# Altium schematic sheet Sensor-Board.SchDoc
size A4; SheetNumber: 4; SheetTotal: 4; Size: A4
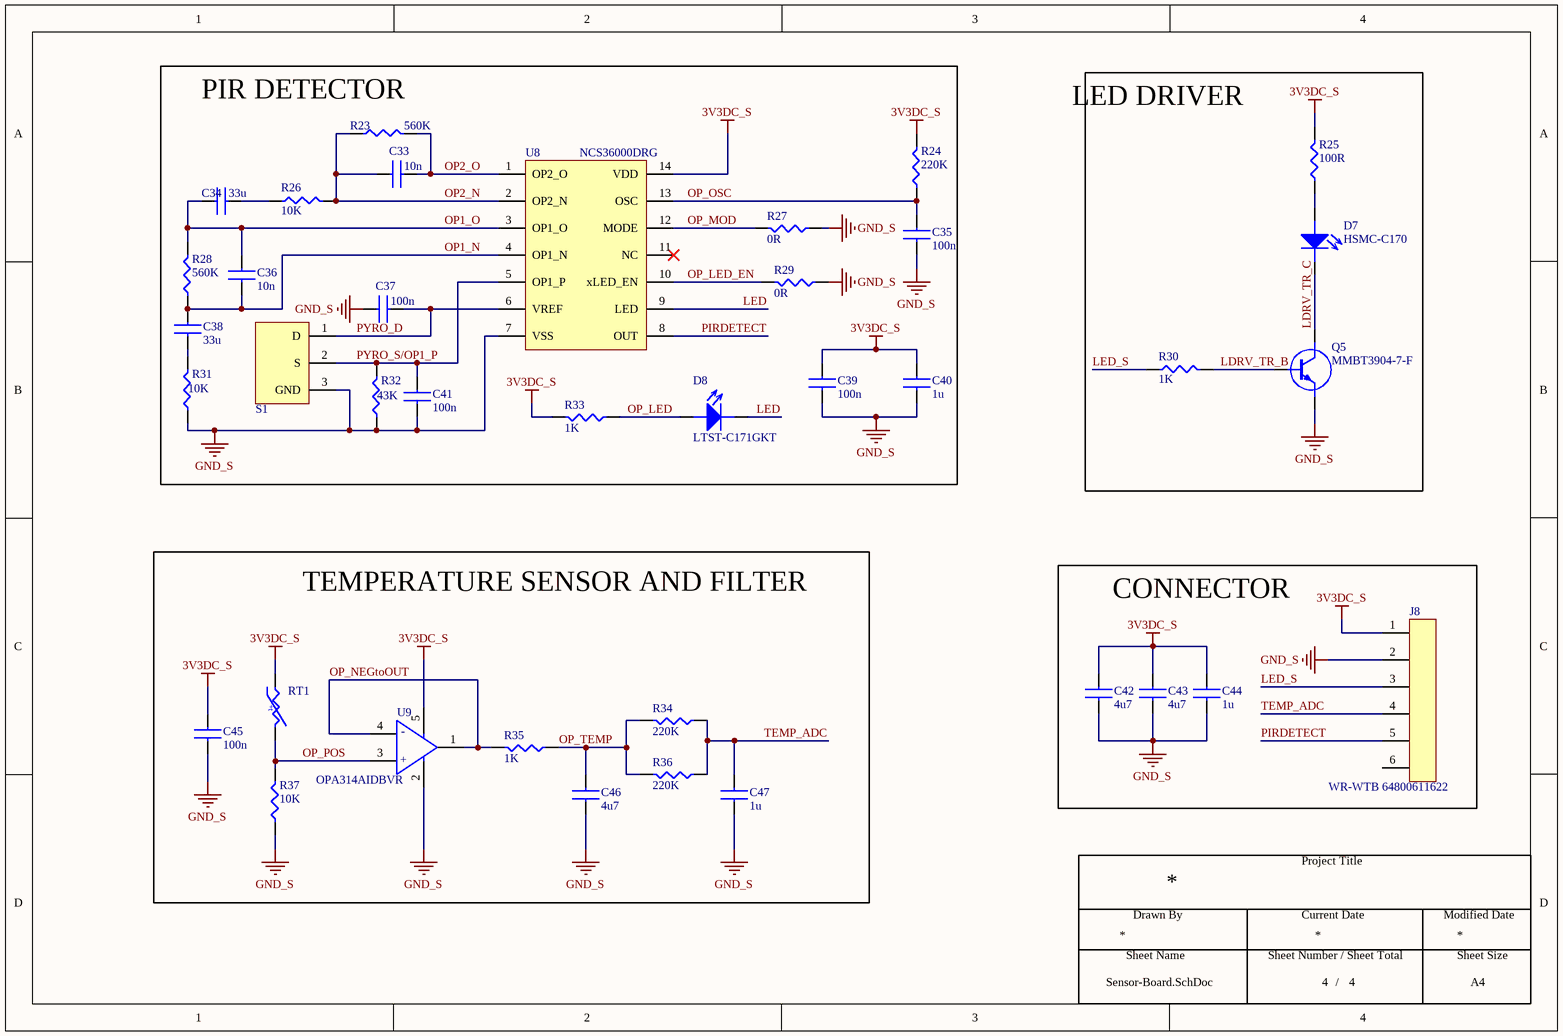
[diagram p0: Sensor-Board.SchDoc]

## Parts
C33  10n  [CAPACITOR 0603]
C34  33u  [CAPACITOR 1206]
C35  100n  [Capacitor 0603]
C36  10n  [CAPACITOR 0603]
C37  100n  [Capacitor 0603]
C38  33u  [CAPACITOR 1206]
C39  100n  [Capacitor 0603]
C40  1u  [CAPACITOR 0805 - duplicate]
C41  100n  [Capacitor 0603]
C42  4u7  [CAPACITOR 0805 - duplicate]
C43  4u7  [CAPACITOR 0805 - duplicate]
C44  1u  [CAPACITOR 0805 - duplicate]
C45  100n  [Capacitor 0603]
C46  4u7  [CAPACITOR 0805 - duplicate]
C47  1u  [CAPACITOR 0805 - duplicate]
D7  HSMC-C170  [LED RED 0805]
D8  LTST-C171GKT  [LED GREEN 0805]
J8  WR-WTB 64800611622  [6P SMD TERMINAL 1.50 MALE]
Q5  MMBT3904-7-F  [SOT-23F]
R23  560K  [Resistor 0603]
R24  220K  [Resistor 0603]
R25  100R  [Resistor 0603]
R26  10K  [Resistor 0603]
R27  0R  [Resistor 0603]
R28  560K  [Resistor 0603]
R29  0R  [Resistor 0603]
R30  1K  [Resistor 0603]
R31  10K  [Resistor 0603]
R32  43K  [Resistor 0603]
R33  1K  [Resistor 0603]
R34  220K  [Resistor 0603]
R35  1K  [Resistor 0603]
R36  220K  [Resistor 0603]
R37  10K  [Resistor 0603]
RT1  TFPT1206L1002FM  [RESISTOR 1206]  (value not drawn)
S1  LHI 878/3902  [LHI 878]  (value not drawn)
U8  NCS36000DRG  [SOIC-14]
U9  OPA314AIDBVR  [SOT23-5]

## Blocks framed on the sheet
PIR DETECTOR: C33-C41 D8 R23 R24 R26-R29 R31-R33 S1 U8
TEMPERATURE SENSOR AND FILTER: C45-C47 R34-R37 RT1 U9
CONNECTOR: C42-C44 J8

## Nets
3V3DC_S: C39.2 C40.2 C42.2 C43.2 C44.2 C45.2 J8.1 R24.2 R25.2 R33.2 RT1.1 U8.14(VDD) U9.5(V+)
GND_S: C35.1 C37.2 C39.1 C40.1 C41.1 C42.1 C43.1 C44.1 C45.1 C46.2 C47.1 J8.2 Q5.2(E) R27.1 R29.1 R31.1 R32.1 R37.1 S1.3(GND) U8.7(VSS) U9.2(V–)
LDRV_TR_B: Q5.1(B) R30.2
LDRV_TR_C: D7.2(C) Q5.3(C)
LED: D8.2(C) U8.9(LED)
LED_S: J8.3 R30.1
OP1_N: C36.1 C38.2 R28.1 U8.4(OP1_N)
OP1_O: C34.1 C36.2 R28.2 U8.3(OP1_O)
OP2_N: C33.1 R23.1 R26.2 U8.2(OP2_N)
OP2_O: C33.2 R23.2 U8.1(OP2_O)
OP_LED: D8.1(A) R33.1
OP_LED_EN: R29.2 U8.10(xLED_EN)
OP_MOD: R27.2 U8.12(MODE)
OP_NEGtoOUT: R35.2 U9.1(OUT) U9.4(-IN)
OP_OSC: C35.2 R24.1 U8.13(OSC)
OP_POS: R37.2 RT1.2 U9.3(+IN)
OP_TEMP: C46.1 R34.2 R35.1 R36.2
PIRDETECT: J8.5 U8.8(OUT)
PYRO_D: C37.1 S1.1(D) U8.6(VREF)
PYRO_S/OP1_P: C41.2 R32.2 S1.2(S) U8.5(OP1_P)
TEMP_ADC: C47.2 J8.4 R34.1 R36.1
NetC34_2: C34.2 R26.1
NetC38_1: C38.1 R31.2
NetD7_1: D7.1(A) R25.1

Not connected (* = marked no-connect by the designer): J8 6; U8 11(NC)*

## Notes on the sheet
- LED DRIVER
- Drawn By
- Project Title
- Current Date
- Modified Date
- Sheet Name
- Sheet Number / Sheet Total
- /
- Sheet Size
- (in symbol OPA314AIDBVR) -; +
- (in symbol TFPT1206L1002FM) +t

## Library data of the parts
C33 C36 = CAP CER 10nF 0603: 0603 16V X7R 10nF 10% multilayer ceramic capacitor; Manufacturer: Walsin Technologies; Manufacturer Part Number: 0603B103K160CT; Designed by: UK; Supplier: Digikey; Supplier Part Number: 1292-1384-6-ND; RoHS: Yes; Category: Ceramic Capacitors; Stock: 66398; Pricing: 1=0.1, 10=0.031, 50=0.018, 100=0.0139, 500=0.0105, 1000=0.00825 (USD); Lead Free: 5697LeadFree; ComponentLink1URL: http://www.farnell.com/datasheets/1958513.pdf?src-supplier=Farnell; ComponentLink1Description: http://www.farnell.com/datasheets/1958513.pdf?src-supplier=Farnell; ComponentLink2URL: https://datasheet.octopart.com/0603B103K160CT-Walsin-Technologies-datasheet-136037192.pdf?src-supplier=Future+Electronics; ComponentLink2Description: https://datasheet.octopart.com/0603B103K160CT-Walsin-Technologies-datasheet-136037192.pdf?src-supplier=Future+Electronics; ComponentLink3URL: http://www.passivecomponent.com/wp-content/uploads/2018/10/MLCC.pdf?src-supplier=Digikey; ComponentLink3Description: http://www.passivecomponent.com/wp-content/uploads/2018/10/MLCC.pdf?src-supplier=Digikey; ComponentLink4URL: https://datasheet.octopart.com/0603B103K160CT-Walsin-Technologies-datasheet-85392065.pdf?src-supplier=Element14; ComponentLink4Description: https://datasheet.octopart.com/0603B103K160CT-Walsin-Technologies-datasheet-85392065.pdf?src-supplier=Element14; ComponentLink5URL: https://datasheet.octopart.com/0603B103K160CT-Walsin-Technologies-datasheet-62066062.pdf?src-supplier=TME; ComponentLink5Description: https://datasheet.octopart.com/0603B103K160CT-Walsin-Technologies-datasheet-62066062.pdf?src-supplier=TME
C34 C38 = CAP CER 33uF 1206: Multilayer Ceramic Capacitor, 33 uF, 25 V, ± 20%, X5R, 1206 [3216 Metric]; Manufacturer: TDK; Manufacturer Part Number: C3216X5R1E336M160AC; Designed by: UK; Material: 4241ConductorMaterial; Supplier: Digikey; Supplier Part Number: 445-8046-2-ND; RoHS: Yes; Category: Ceramic Capacitors; Stock: 166000; Pricing: 2000=0.3605, 4000=0.34763, 10000=0.33475, 14000=0.32831 (USD); ComponentLink1URL: https://datasheet.ciiva.com/24216/c3216x5r1e336m160ac-265051-24216512.pdf?src-supplier=Mouser; ComponentLink1Description: https://datasheet.ciiva.com/24216/c3216x5r1e336m160ac-265051-24216512.pdf?src-supplier=Mouser; ComponentLink2URL: https://datasheet.ciiva.com/6285/tdkmlcccaprange-6285278.pdf?src-supplier=Digikey; ComponentLink2Description: https://datasheet.ciiva.com/6285/tdkmlcccaprange-6285278.pdf?src-supplier=Digikey
C35 C37 C39 C41 C45 = CAP CER 100nF 0603: Multilayer Ceramic Capacitor, 0.1 uF, 50 V, ± 10%, X7R, 0603 [1608 Metric]; Manufacturer: KEMET; Manufacturer Part Number: C0603C104K5RACTU; Material: 4241ConductorMaterial; Value: 100nF; Voltage Rating: 50V; Temperature Coefficient: 30ppm/°C; Designed by: UK; Supplier: Digikey; Supplier Part Number: 399-C0603C104K5RAC7867TR-ND; RoHS: Yes; Category: Ceramic Capacitors; Stock: 3063153; Pricing: 4000=0.01394, 8000=0.01273, 12000=0.01212, 28000=0.01151, 100000=0.00833, 200000=0.00806, 400000=0.00758 (USD); Mounting Technology: Surface Mount; Case/Package: 0603; Min Operating Temperature: -55°C; Max Operating Temperature: 125°C; Tolerance: 10%; Dielectric: X7R; Packaging: Tape and Reel; Voltage: 50V; Series: SMD Comm X7R; Length: 0.063inch; Width: 0.031inch; Thickness: 0.034inch; RoHS Compliant: Yes; Lead Free: 5697LeadFree
C40 C44 C47 = CAP CER 1uF 0805: Multilayer Ceramic Capacitor, 1 uF, 50 V, ± 10%, X7R, 0805 [2012 Metric]; Manufacturer: Samsung; Manufacturer Part Number: CL21B105KBFNNNE; Designed by: UK; Voltage Rating (DC): 50V; Value: 1uF; Supplier: Digikey; Supplier Part Number: 1276-1029-2-ND; RoHS: Yes; Category: Ceramic Capacitors; Stock: 1265790; Pricing: 2000=0.02015, 4000=0.01844, 10000=0.01715, 14000=0.01629, 50000=0.01415, 100000=0.01169, 200000=0.0114 (USD); Mounting Technology: Surface Mount; Case/Package: 0805; Material: Ceramic; Case Code (Metric): 2012; Case Code (Imperial): 0805; Min Operating Temperature: -55°C; Max Operating Temperature: 125°C; Tolerance: 10%; Packaging: Tape and Reel; Package Quantity: 1; Voltage Rating: 50V; Dielectric: X7R; Voltage: 50V; Series: CL; Construction: Flat; Length: 2mm; Width: 0.049inch; Height: 1.25mm; Thickness: 0.053inch; Depth: 1.25mm; Radiation Hardening: No; RoHS Compliant: Yes; ComponentLink1URL: https://datasheet.ciiva.com/25800/cl21b105kbfnnne-25800291.pdf?src-supplier=Digikey; ComponentLink1Description: https://datasheet.ciiva.com/25800/cl21b105kbfnnne-25800291.pdf?src-supplier=Digikey
C42 C43 C46 = CAP CER 4.7uF 0805: Multilayer Ceramic Capacitor, 4.7 uF, 25 V, ± 10%, X5R, 0805 [2012 Metric]; Manufacturer: Samsung; Manufacturer Part Number: CL21A475KAQNNNE; Designed by: UK; Value: 4.7uF; Voltage Rating: 25V; Supplier: Digikey; Supplier Part Number: 1276-1244-2-ND; RoHS: Yes; Category: Ceramic Capacitors; Stock: 3213374; Pricing: 2000=0.01305, 4000=0.01194, 10000=0.0111, 14000=0.01055, 50000=0.00978 (USD); Mounting Technology: Surface Mount; Case/Package: 0805; Case Code (Metric): 2012; Case Code (Imperial): 0805; Material: Ceramic; Min Operating Temperature: -55°C; Max Operating Temperature: 85°C; Packaging: Tape and Reel; Tolerance: 10%; Dielectric: X5R; Voltage Rating (DC): 25V; Series: CL; Construction: Flat; Length: 2mm; Height: 1.25mm; Depth: 1.25mm; Radiation Hardening: No; Lead Free: Lead Free; RoHS Compliant: Yes; ComponentLink1URL: https://datasheet.ciiva.com/25798/cl21a475kaqnnne-25798882.pdf?src-supplier=Digikey; ComponentLink1Description: https://datasheet.ciiva.com/25798/cl21a475kaqnnne-25798882.pdf?src-supplier=Digikey
D7 = LED RED 0805: Single Color LED, Red, Untinted Diffused, 1.4mm; Manufacturer: Broadcom Avago; Designed by: UK; Supplier: Digikey; Supplier Part Number: 516-1428-6-ND; Manufacturer Part Number: HSMC-C170; RoHS: Yes; Category: LEDs; Stock: 40108; Pricing: 1=0.62, 10=0.38, 100=0.2182, 1000=0.1708, 2000=0.15657 (USD); Lead Free: 5697LeadFree
D8 = LED GREEN 0805: LED Low-Power Uni-Color Green 565nm 2.1V 2-Pin Chip LED T/R; Manufacturer: Vishay Lite-On; Designed by: UK; Lens Color: Colorless; Viewing Angle: 130°; Lens Style: Flat,Diffused,Colorless,Rectangular,Clear; Luminous Intensity: 12mcd; Forward Current: 30mA; Power Rating: 100mW; Dominant Wavelength: 569nm; Test Current: 10mA; Lens Transparency: Clear; Number of Elements: 1; Reverse Voltage: 5V; Lens Size: 1.25mm; Supplier: Digikey; Supplier Part Number: 160-1423-2-ND; Manufacturer Part Number: LTST-C171GKT; RoHS: Yes; Category: LEDs; Stock: 357000; Pricing: 3000=0.04692, 6000=0.0408, 15000=0.03672, 30000=0.03264, 75000=0.02958, 150000=0.02754 (USD); Mounting Technology: Surface Mount; Case/Package: 0805; Pins: 2; Color: Green; Case Code (Metric): 2012; Case Code (Imperial): 0805; Min Operating Temperature: -55°C; Max Operating Temperature: 85°C; Package Quantity: 3000; Packaging: Tape and Reel; Forward Voltage: 2.1V; Illumination Color: Green; Power Dissipation: 100mW; Wavelength: 565nm; Number of LEDs: 1; Series: -; Length: 2mm; Width: 1.25mm; Height: 0.9mm; Depth: 1.25mm; Radiation Hardening: No; Lead Free: Lead Free; RoHS Compliant: Yes; ComponentLink1URL: https://datasheet.ciiva.com/2110/ltst-c171gkt-2110000.pdf?src-supplier=Digikey; ComponentLink1Description: https://datasheet.ciiva.com/2110/ltst-c171gkt-2110000.pdf?src-supplier=Digikey; ComponentLink2URL: https://datasheet.ciiva.com/11773/0900766b80dc0296-11773991.pdf?src-supplier=Rs; ComponentLink2Description: https://datasheet.ciiva.com/11773/0900766b80dc0296-11773991.pdf?src-supplier=Rs; ComponentLink3URL: https://datasheet.ciiva.com/12400/lite-on-ltst-c171gkt-190133-12400647.pdf?src-supplier=Mouser; ComponentLink3Description: https://datasheet.ciiva.com/12400/lite-on-ltst-c171gkt-190133-12400647.pdf?src-supplier=Mouser; ComponentLink4URL: https://datasheet.ciiva.com/2110/ltst-c171gkt-2110001.pdf?src-supplier=Digikey; ComponentLink4Description: https://datasheet.ciiva.com/2110/ltst-c171gkt-2110001.pdf?src-supplier=Digikey; ComponentLink5URL: https://datasheet.ciiva.com/2110/ltst-c171gkt-2110002.pdf?src-supplier=Digikey; ComponentLink5Description: https://datasheet.ciiva.com/2110/ltst-c171gkt-2110002.pdf?src-supplier=Digikey; ComponentLink6URL: https://datasheet.ciiva.com/16396/ltst-c171gkt-16396549.pdf?src-supplier=Future+Electronics; ComponentLink6Description: https://datasheet.ciiva.com/16396/ltst-c171gkt-16396549.pdf?src-supplier=Future+Electronics
J8 = 6P SMD TERMINAL 1.50 MALE: WR-WTB Wire-to-Board Connectors 1.50 mm; Manufacturer: Wurth Electronics; Designed by: UK; Supplier: Digikey; Supplier Part Number: 732-64800611622-ND; Manufacturer Part Number: 64800611622; RoHS: No; Category: Uncategorized; Stock: 1319; Pricing: 1=0.42, 50=0.406, 100=0.384, 250=0.361, 500=0.339 (USD)
Q5 = MMBT3904-7-F: Transistor General Purpose BJT NPN 40 Volt 0.2A Automotive 3-Pin SOT-23; Manufacturer: Diodes Zetex; Designed by: UK; Max Power Dissipation: 300mW; Collector Emitter Voltage (VCEO): 40V; Max Collector Current: 200mA; Collector Base Voltage (VCBO): 60V; Power Dissipation: 350mW; Frequency: 300MHz; hFE Min: 100; Number of Elements: 1; Emitter Base Voltage (VEBO): 6V; Collector Emitter Saturation Voltage: 300mV; Supplier: Digikey; Supplier Part Number: MMBT3904-FDICT-ND; Manufacturer Part Number: MMBT3904-7-F; RoHS: Yes; Category: BJTs; Stock: 4408549; Pricing: 1=0.12, 10=0.086, 100=0.0467, 500=0.03666, 1000=0.02545 (USD); Mounting Technology: Surface Mount; Case/Package: SOT-23; Pins: 3; Weight: 0.000282oz; Min Operating Temperature: -55°C; Max Operating Temperature: 150°C; Polarity: NPN; Packaging: Tape and Reel; Voltage Rating (DC): 40V; Package Quantity: 3000; Transition Frequency: 300MHz; Collector Emitter Breakdown Voltage: 40V; Max Breakdown Voltage: 40V; Continuous Collector Current: 200mA; Clock Frequency: 300MHz; Gain Bandwidth Product: 300MHz; Series: Automotive, AEC-Q101; Collector-emitter Voltage-Max: 300mV; Length: 3.05mm; Width: 1.4mm; Height: 1mm; Radiation Hardening: No; Reach SVHC Compliant: No; Lead Free: Lead Free; RoHS Compliant: Yes; ComponentLink1URL: https://datasheet.ciiva.com/11201/ds30036-11201778.pdf?src-supplier=Avnet; ComponentLink1Description: https://datasheet.ciiva.com/11201/ds30036-11201778.pdf?src-supplier=Avnet; ComponentLink2URL: https://datasheet.ciiva.com/15138/getdatasheetpartid-53265-15138780.pdf?src-supplier=Verical; ComponentLink2Description: https://datasheet.ciiva.com/15138/getdatasheetpartid-53265-15138780.pdf?src-supplier=Verical; ComponentLink3URL: https://datasheet.ciiva.com/22711/1915516-22711750.pdf?src-supplier=Element14; ComponentLink3Description: https://datasheet.ciiva.com/22711/1915516-22711750.pdf?src-supplier=Element14; ComponentLink4URL: https://datasheet.ciiva.com/11198/ds30036-11198999.pdf?src-supplier=Avnet; ComponentLink4Description: https://datasheet.ciiva.com/11198/ds30036-11198999.pdf?src-supplier=Avnet; ComponentLink5URL: https://datasheet.ciiva.com/6361/ds30036-6361256.pdf?src-supplier=Digikey; ComponentLink5Description: https://datasheet.ciiva.com/6361/ds30036-6361256.pdf?src-supplier=Digikey; ComponentLink6URL: https://datasheet.ciiva.com/6361/ds30036-6361254.pdf?src-supplier=Digikey; ComponentLink6Description: https://datasheet.ciiva.com/6361/ds30036-6361254.pdf?src-supplier=Digikey
R23 R28 = RES 560K 0603: SMD Chip Resistor, 560 kOhm, ± 5%, 100 mW, 0603 [1608 Metric], Thick Film, General Purpose; Manufacturer: Yageo; Manufacturer Part Number: RC0603JR-07560KL; Designed by: UK; Value: 560kR; Power Rating: 100mW; Voltage Rating: 75V; Voltage Rating (DC): 50V; Temperature Coefficient: 100ppm/°C; Supplier: Digikey; Supplier Part Number: 311-560KGRDKR-ND; RoHS: Yes; Category: Chip SMD Resistors; Stock: 410968; Pricing: 1=0.1, 10=0.015, 50=0.0092, 100=0.0076, 500=0.00512, 1000=0.00437 (USD); Case/Package: 0603; Pins: 2; Case Code (Metric): 1608; Case Code (Imperial): 0603; Weight: 7.1E-05oz; Min Operating Temperature: -55°C; Max Operating Temperature: 155°C; Package Quantity: 1; Tolerance: 5%; Packaging: Tape and Reel; Resistor Type: Thick Film; Number of Terminations: 2; Termination: SMD/SMT; Max Power Dissipation: 100mW; Working Voltage: 75V; Features: Moisture Resistant; Series: RC; Resistance Tolerance: 5%; Technology: THICK FILM; Voltage Rating (AC): 50V; Length: 0.063inch; Width: 0.8mm; Height: 0.022inch; RoHS Compliant: Yes; Reach SVHC Compliant: Unknown; Lead Free: 5697LeadFree; ComponentLink1URL: https://datasheet.ciiva.com/2453/pyu-r-int-thick-7-2453056.pdf?src-supplier=Digikey; ComponentLink1Description: https://datasheet.ciiva.com/2453/pyu-r-int-thick-7-2453056.pdf?src-supplier=Digikey; ComponentLink2URL: https://datasheet.ciiva.com/2453/pyu-r-int-thick-7-2453057.pdf?src-supplier=Digikey; ComponentLink2Description: https://datasheet.ciiva.com/2453/pyu-r-int-thick-7-2453057.pdf?src-supplier=Digikey; ComponentLink3URL: https://datasheet.ciiva.com/2453/pyu-r-int-thick-7-2453055.pdf?src-supplier=Digikey; ComponentLink3Description: https://datasheet.ciiva.com/2453/pyu-r-int-thick-7-2453055.pdf?src-supplier=Digikey
R24 R34 R36 = RES 220K 0603: SMD Chip Resistor, 220 kOhm, ± 5%, 100 mW, 0603 [1608 Metric], Thick Film, General Purpose; Manufacturer: Yageo; Manufacturer Part Number: RC0603JR-07220KL; Designed by: UK; Voltage Rating (AC): 50V; Supplier: Digikey; Supplier Part Number: 311-220KGRTR-ND; RoHS: Yes; Category: Chip SMD Resistors; Stock: 650000; Pricing: 5000=0.00314, 10000=0.00275, 25000=0.00236, 35000=0.00228, 50000=0.00211, 125000=0.00191 (USD); Lead Free: 5697LeadFree; ComponentLink1URL: https://datasheet.ciiva.com/2452/pyu-r-int-thick-7-2452923.pdf?src-supplier=Digikey; ComponentLink1Description: https://datasheet.ciiva.com/2452/pyu-r-int-thick-7-2452923.pdf?src-supplier=Digikey; ComponentLink2URL: https://datasheet.ciiva.com/2452/pyu-r-int-thick-7-2452924.pdf?src-supplier=Digikey; ComponentLink2Description: https://datasheet.ciiva.com/2452/pyu-r-int-thick-7-2452924.pdf?src-supplier=Digikey; ComponentLink3URL: https://datasheet.ciiva.com/2452/pyu-r-int-thick-7-2452925.pdf?src-supplier=Digikey; ComponentLink3Description: https://datasheet.ciiva.com/2452/pyu-r-int-thick-7-2452925.pdf?src-supplier=Digikey
R25 = RES 100R 0603: SMD Chip Resistor, 100 Ohm, ± 5%, 100 mW, 0603 [1608 Metric], Thick Film, General Purpose; Manufacturer: Yageo; Manufacturer Part Number: RC0603JR-07100RL; Designed by: UK; Temperature Coefficient: 100ppm/°C; Voltage Rating (DC): 50V; Power Rating: 100mW; Supplier: Digikey; Supplier Part Number: 311-100GRDKR-ND; RoHS: Yes; Category: Chip SMD Resistors; Stock: 1088098; Pricing: 1=0.1, 10=0.015, 50=0.0092, 100=0.0076, 500=0.00512, 1000=0.00437 (USD); Case/Package: 0603; Pins: 2; Contact Plating: Tin,Matte; Case Code (Imperial): 0603; Case Code (Metric): 1608; Min Operating Temperature: -55°C; Max Operating Temperature: 155°C; Value: 100R; Tolerance: 5%; Resistor Type: Thick Film; Packaging: Tape and Reel; Voltage Rating: 50V; Termination: SMD/SMT; Features: Moisture Resistant; Series: RC; Max Power Dissipation: 100mW; Number of Terminations: 2; Construction: Rectangular; Resistance Tolerance: 5%; Voltage Rating (AC): 50V; Length: 1.6mm; Width: 0.8mm; Depth: 0.8mm; Lead Free: Lead Free; Reach SVHC Compliant: Unknown; Military Standard: Not; RoHS Compliant: Yes; ComponentLink1URL: https://datasheet.ciiva.com/7746/443971-7746425.pdf?src-supplier=Element14; ComponentLink1Description: https://datasheet.ciiva.com/7746/443971-7746425.pdf?src-supplier=Element14; ComponentLink2URL: https://datasheet.ciiva.com/7746/443971-7746426.pdf?src-supplier=Element14; ComponentLink2Description: https://datasheet.ciiva.com/7746/443971-7746426.pdf?src-supplier=Element14; ComponentLink3URL: https://datasheet.ciiva.com/8883/pyu-rc0603-51-rohs-l-4-8883047.pdf?src-supplier=Avnet; ComponentLink3Description: https://datasheet.ciiva.com/8883/pyu-rc0603-51-rohs-l-4-8883047.pdf?src-supplier=Avnet; ComponentLink4URL: https://datasheet.ciiva.com/15189/getdatasheetpartid-325207-15189846.pdf?src-supplier=Verical; ComponentLink4Description: https://datasheet.ciiva.com/15189/getdatasheetpartid-325207-15189846.pdf?src-supplier=Verical
R26 R31 R37 = RES 10K 0603: SMD Chip Resistor, 10 kOhm, ± 1%, 100 mW, 0603 [1608 Metric], Thick Film, General Purpose; Manufacturer: Yageo; Manufacturer Part Number: RC0603FR-0710KL; Value: 10kR; Power Rating: 100mW; Voltage Rating: 75V; Temperature Coefficient: 100ppm/°C; Voltage Rating (DC): 50V; Designed by: UK; Supplier: Digikey; Supplier Part Number: 311-10.0KHRTR-ND; RoHS: Yes; Category: Chip SMD Resistors; Stock: 11745000; Pricing: 5000=0.00382, 10000=0.00335, 25000=0.00287, 35000=0.00278, 50000=0.00257, 125000=0.00232 (USD); Case/Package: 0603; Pins: 2; Case Code (Imperial): 0603; Case Code (Metric): 1608; Weight: 7.1E-05oz; Min Operating Temperature: -55°C; Max Operating Temperature: 155°C; Tolerance: 1%; Series: RC; Packaging: Tape and Reel; Termination: SMD/SMT; Max Power Dissipation: 100mW; Resistor Type: Thick Film; Number of Terminations: 2; Resistance Tolerance: 1%; Features: Moisture Resistant; Construction: Rectangular; Length: 1.6mm; Width: 0.8mm; Height: 0.45mm; Depth: 0.8mm; Lead Pitch: 0.3mm; RoHS Compliant: Yes; Lead Free: 5697LeadFree; Reach SVHC Compliant: No; Military Standard: Not
R27 R29 = RES 0R 0603: GENERAL PURPOSE CHIP RESISTOR Metal Glaze/thick Film, 0.1W, 0ohm, Surface Mount, 0603; Manufacturer: Yageo; Manufacturer Part Number: RC0603JR-070RL; Designed by: UK; Value: 0mR; Tolerance: 1%; Power Rating: 100mW; Voltage Rating (DC): 50V; Temperature Coefficient: 200ppm/°C; Resistance Tolerance: 5%; Supplier: Digikey; Supplier Part Number: 311-0.0GRTR-ND; RoHS: Yes; Category: Chip SMD Resistors; Stock: 3621361; Pricing: 5000=0.00203, 10000=0.00177, 25000=0.00155, 50000=0.00142, 125000=0.00139 (USD); Case/Package: 0603; Pins: 2; Contact Plating: Tin,Matte; Case Code (Imperial): 0603; Case Code (Metric): 1608; Min Operating Temperature: -55°C; Max Operating Temperature: 155°C; Resistor Type: Thick Film; Packaging: Tape and Reel; Termination: SMD/SMT; Series: RC; Technology: THICK FILM; Package Quantity: 5000; Voltage Rating: 50V; Features: Moisture Resistant; Max Power Dissipation: 100mW; Number of Terminations: 2; Construction: Rectangular; Length: 1.6mm; Width: 0.8mm; Height: 0.45mm; Depth: 0.8mm; Reach SVHC Compliant: Unknown; Lead Free: 5697LeadFree; RoHS Compliant: Yes; Military Standard: Not
R30 R33 R35 = RES 1K 0603: SMD Chip Resistor, 1 kOhm, ± 1%, 100 mW, 0603 [1608 Metric], Thick Film, General Purpose; Manufacturer: Yageo; Manufacturer Part Number: RC0603FR-071KL; Designed by: UK; Value: 1kR; Temperature Coefficient: 100ppm/°C; Power Rating: 100mW; Voltage Rating: 50V; Supplier: Digikey; Supplier Part Number: 311-1.00KHRCT-ND; RoHS: Yes; Category: Chip SMD Resistors; Stock: 12285830; Pricing: 1=0.1, 10=0.019, 50=0.0112, 100=0.0093, 500=0.00622, 1000=0.00532 (USD); Case/Package: 0603; Contact Plating: Tin,Matte; Case Code (Imperial): 0603; Case Code (Metric): 1608; Min Operating Temperature: -55°C; Max Operating Temperature: 155°C; Tolerance: 1%; Resistor Type: Thick Film; Packaging: Tape and Reel; Termination: SMD/SMT; Features: Moisture Resistant; Series: RC; Max Power Dissipation: 100mW; Number of Terminations: 2; Technology: THICK FILM; Resistance Tolerance: 1%; Construction: Rectangular; Length: 1.6mm; Height: 0.45mm; Depth: 0.8mm; Reach SVHC Compliant: No; Lead Free: 5697LeadFree; Military Standard: Not; RoHS Compliant: Yes
R32 = RES 43K 0603: Res Thick Film 0603 43K Ohm 5% 0.1W(1/10W) ±100ppm/°C Pad SMD T/R; Manufacturer: Yageo; Manufacturer Part Number: RC0603JR-0743KL; Designed by: UK; Supplier: Digikey; Supplier Part Number: 311-43KGRDKR-ND; RoHS: Yes; Category: Chip SMD Resistors; Stock: 230924; Pricing: 1=0.1, 10=0.011, 50=0.0066, 100=0.0054, 500=0.0036, 1000=0.00307 (USD); ComponentLink1URL: https://datasheet.ciiva.com/2453/pyu-r-int-thick-7-2453052.pdf?src-supplier=Digikey; ComponentLink1Description: https://datasheet.ciiva.com/2453/pyu-r-int-thick-7-2453052.pdf?src-supplier=Digikey; ComponentLink2URL: https://datasheet.ciiva.com/2453/pyu-r-int-thick-7-2453053.pdf?src-supplier=Digikey; ComponentLink2Description: https://datasheet.ciiva.com/2453/pyu-r-int-thick-7-2453053.pdf?src-supplier=Digikey; ComponentLink3URL: https://datasheet.ciiva.com/2453/pyu-r-int-thick-7-2453054.pdf?src-supplier=Digikey; ComponentLink3Description: https://datasheet.ciiva.com/2453/pyu-r-int-thick-7-2453054.pdf?src-supplier=Digikey
RT1 = TFPT1206L1002FM: Thermistor PTC 10K Ohm 1% 2-Pin 1206 Surface Mount Solder Pad T/R Automotive; Manufacturer: Vishay Dale; Value: 10kR; Power Rating: 125mW; Voltage: 40V; Designed by: UK; Supplier: Mouser; Supplier Part Number: 71-TFPT1206L1002FM; Manufacturer Part Number: TFPT1206L1002FM; RoHS: Yes; Category: Linear ICs; Stock: 36400; Pricing: 1=1.3, 10=0.794, 50=0.794, 100=0.702, 1000=0.504, 10000=0.453 (USD); Mounting Technology: Surface Mount; Case/Package: 1206; Case Code (Imperial): 1206; Min Operating Temperature: -55°C; Max Operating Temperature: 125°C; Packaging: Tape and Reel; Package Quantity: 5000; Tolerance: 1%; Max Power Dissipation: 125mW; Termination: SMD/SMT; Series: TFPT; Resistance Tolerance: 1%; Length: 3.2mm; Width: 1.6mm; Height: 0.55mm; Lead Free: Lead Free; RoHS Compliant: Yes; ComponentLink1URL: https://datasheet.ciiva.com/2852/tfpt-2852076.pdf?src-supplier=Digikey; ComponentLink1Description: https://datasheet.ciiva.com/2852/tfpt-2852076.pdf?src-supplier=Digikey
S1 = LHI 878/3902: Sensor Pyro Detector Dual Motion; Manufacturer: Excelitas; Designed by: UK; Supplier: Digikey; Supplier Part Number: 1601-LHI878/3902-ND; Manufacturer Part Number: LHI878/3902; RoHS: No; Category: Uncategorized
U8 = NCS36000DRG: NCS36000 Series Single 5.75V Passive Infrared Detector Controller (PIR) -SOIC-14; Manufacturer: ON Semiconductor; Designed by: UK; Operating Supply Current: 50uA; Quiescent Current: 20uA; Min Supply Voltage: 3V; Output Type: Digital; Supplier: Rs; Supplier Part Number: 8051766P; Manufacturer Part Number: NCS36000DRG; RoHS: Yes; Category: Amplifiers - Op Amps, Buffer, Instrumentation; Pricing: 50=0.757, 100=0.659 (GBP); Case/Package: SOIC; Pins: 14; Min Operating Temperature: -40°C; Max Operating Temperature: 85°C; Package Quantity: 3000; Packaging: Tape and Reel; Max Supply Voltage: 5.75V; Series: -; Input Type: DIGITAL; Nominal Supply Current: 20uA; Length: 8.75mm; Width: 4mm; Height: 1.5mm; Radiation Hardening: No; Reach SVHC Compliant: No; Lead Free: Lead Free; Halogen Free: Halogen Free; RoHS Compliant: Yes; ComponentLink1URL: https://datasheet.ciiva.com/4763/ncs36000-d-89569-4763639.pdf?src-supplier=Mouser; ComponentLink1Description: https://datasheet.ciiva.com/4763/ncs36000-d-89569-4763639.pdf?src-supplier=Mouser; ComponentLink2URL: https://datasheet.ciiva.com/2966/ncs36000-d-2966525.pdf?src-supplier=Avnet; ComponentLink2Description: https://datasheet.ciiva.com/2966/ncs36000-d-2966525.pdf?src-supplier=Avnet
U9 = OPA314AIDBVR: IC OPAMP GP 3MHZ RRO SOT23-5; Manufacturer: Texas Instruments; Designed by: UK; Supplier: Digikey; Supplier Part Number: 296-36699-2-ND; Manufacturer Part Number: OPA314AIDBVR; RoHS: Yes; Category: Amplifiers - Op Amps, Buffer, Instrumentation; Stock: 10500; Pricing: 3000=0.49066, 6000=0.46613, 15000=0.4486 (USD); ComponentLink1URL: https://datasheet.ciiva.com/14456/opa2314-14456281.pdf?src-supplier=Avnet; ComponentLink1Description: https://datasheet.ciiva.com/14456/opa2314-14456281.pdf?src-supplier=Avnet; ComponentLink2URL: https://datasheet.ciiva.com/14462/opa2314-14462006.pdf?src-supplier=Avnet; ComponentLink2Description: https://datasheet.ciiva.com/14462/opa2314-14462006.pdf?src-supplier=Avnet; ComponentLink3URL: https://datasheet.ciiva.com/29638/opa314-29638827.pdf?src-supplier=Digikey; ComponentLink3Description: https://datasheet.ciiva.com/29638/opa314-29638827.pdf?src-supplier=Digikey